# Altium project vcu.PrjPcb
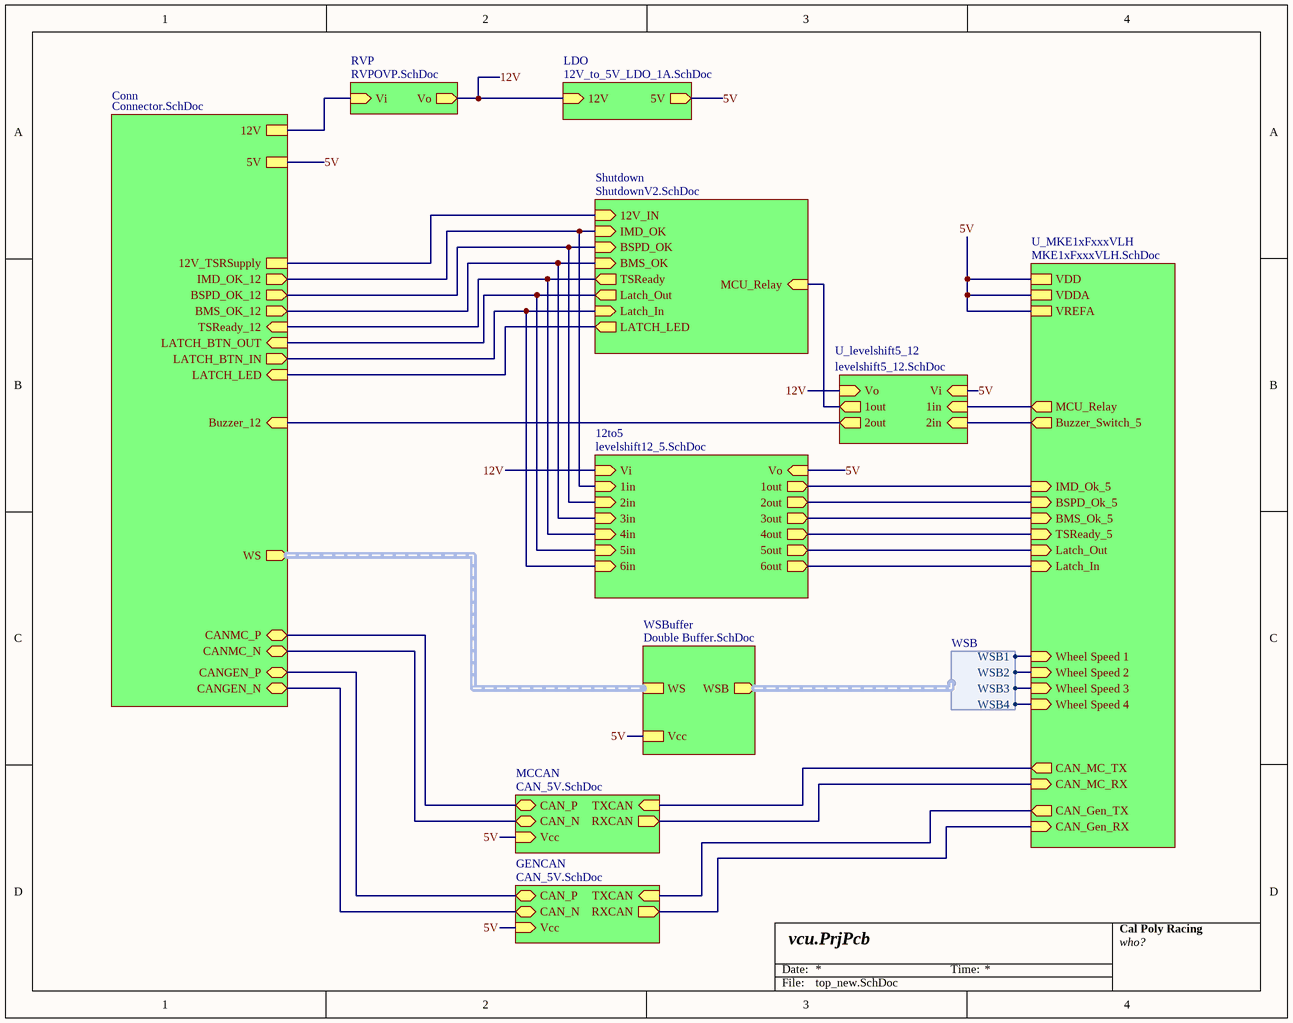
[diagram p0: top_new.SchDoc]
11 sheets, 99 parts. Net scope: hierarchical (ports join the sheet entries above them; power ports are global).
Board file: vcu.PcbDoc
Sheets:
  top_new.SchDoc
    Conn = Connector.SchDoc
    WSBuffer = Double Buffer.SchDoc
    RVP = RVPOVP.SchDoc
    LDO = 12V_to_5V_LDO_1A.SchDoc
    Shutdown = ShutdownV2.SchDoc
    12to5 = levelshift12_5.SchDoc
    U_levelshift5_12 = levelshift5_12.SchDoc
    U_MKE1xFxxxVLH = MKE1xFxxxVLH.SchDoc
      LED 1 = LED.SchDoc
      LED 3 = LED.SchDoc
      LED 4 = LED.SchDoc
      LED 2 = LED.SchDoc
    MCCAN = CAN_5V.SchDoc
    GENCAN = CAN_5V.SchDoc

## Sheet top_new.SchDoc
size A; Organization: Cal Poly Racing; engineer1: who?

### Sub-sheets
12to5 = levelshift12_5.SchDoc: Vi (in), 1in (in), 2in (in), 3in (in), 4in (in), 5in (in), 6in (in), 1out (out), 2out (out), 3out (out), 4out (out), 5out (out), 6out (out), Vo (in)
Conn = Connector.SchDoc: IMD_OK_12 (out), CANMC_P (bidir), TSReady_12 (in), CANGEN_N (bidir), LATCH_BTN_IN (out), 12V_TSRSupply, LATCH_BTN_OUT (in), BMS_OK_12 (out), CANMC_N (bidir), BSPD_OK_12 (out), CANGEN_P (bidir), Buzzer_12 (in), LATCH_LED (in), 12V, 5V, WS (out, harness WS)
GENCAN = CAN_5V.SchDoc: TXCAN (in), RXCAN (out), CAN_N (bidir), CAN_P (bidir), Vcc (in)
LDO = 12V_to_5V_LDO_1A.SchDoc: 12V (in), 5V (out)
MCCAN = CAN_5V.SchDoc: TXCAN (in), RXCAN (out), CAN_N (bidir), CAN_P (bidir), Vcc (in)
RVP = RVPOVP.SchDoc: Vo (out), Vi (in)
Shutdown = ShutdownV2.SchDoc: BMS_OK (in), IMD_OK (in), MCU_Relay (in), LATCH_LED (out), TSReady (out), Latch_Out (out), Latch_In (in), BSPD_OK (in), 12V_IN (in)
U_levelshift5_12 = levelshift5_12.SchDoc: Vi (in), 1in (in), 2in (in), 1out (out), 2out (out), Vo (in)
U_MKE1xFxxxVLH = MKE1xFxxxVLH.SchDoc: VDD, VDDA, VREFA, BSPD_Ok_5 (in), BMS_Ok_5 (in), IMD_Ok_5 (in), Latch_In (in), TSReady_5 (in), Latch_Out (in), MCU_Relay (out), Buzzer_Switch_5 (out), CAN_MC_RX (in), Wheel Speed 2 (in), Wheel Speed 3 (in), Wheel Speed 4 (in), CAN_MC_TX (out), Wheel Speed 1 (in), CAN_Gen_TX (out), CAN_Gen_RX (in)
WSBuffer = Double Buffer.SchDoc: Vcc, WS, WSB (out, harness WSB)

### Harnesses
WSB: WSB1, WSB2, WSB3, WSB4

### Nets
5V: sheet Conn/5V, sheet WSBuffer/Vcc, sheet LDO/5V, sheet 12to5/Vo, sheet U_levelshift5_12/Vi, sheet U_MKE1xFxxxVLH/VDD, sheet U_MKE1xFxxxVLH/VDDA, sheet U_MKE1xFxxxVLH/VREFA, sheet MCCAN/Vcc, sheet GENCAN/Vcc
12V: sheet RVP/Vo, sheet LDO/12V, sheet 12to5/Vi, sheet U_levelshift5_12/Vo
12VTSR: sheet Conn/12V_TSRSupply, sheet Shutdown/12V_IN
CAN_N: sheet Conn/CANMC_N, sheet MCCAN/CAN_N
CAN_N: sheet Conn/CANGEN_N, sheet GENCAN/CAN_N  [a separate net that carries the same name]
CAN_P: sheet Conn/CANMC_P, sheet MCCAN/CAN_P
CAN_P: sheet Conn/CANGEN_P, sheet GENCAN/CAN_P  [a separate net that carries the same name]
RVPI: sheet Conn/12V, sheet RVP/Vi
NetD10#1_2: sheet Conn/LATCH_BTN_IN, sheet Shutdown/Latch_In, sheet 12to5/6in
NetK3_NO: sheet Conn/LATCH_BTN_OUT, sheet Shutdown/Latch_Out, sheet 12to5/5in
NetLATCH_RELAY1_2: sheet Conn/LATCH_LED, sheet Shutdown/LATCH_LED
NetLATCH_RELAY1_6: sheet Conn/TSReady_12, sheet Shutdown/TSReady, sheet 12to5/4in
NetR15_2: sheet U_levelshift5_12/1in, sheet U_MKE1xFxxxVLH/MCU_Relay
NetR16_2: sheet U_levelshift5_12/2in, sheet U_MKE1xFxxxVLH/Buzzer_Switch_5
NetR24#1_2: sheet Conn/IMD_OK_12, sheet Shutdown/IMD_OK, sheet 12to5/1in
NetR25#1_2: sheet Conn/BSPD_OK_12, sheet Shutdown/BSPD_OK, sheet 12to5/2in
NetR26#1_2: sheet Conn/BMS_OK_12, sheet Shutdown/BMS_OK, sheet 12to5/3in
NetU2_4: sheet U_MKE1xFxxxVLH/Wheel Speed 2, sheet WSBuffer/WSB.WSB2
NetU2_6: sheet U_MKE1xFxxxVLH/Wheel Speed 1, sheet WSBuffer/WSB.WSB1
NetU3_4: sheet U_MKE1xFxxxVLH/Wheel Speed 4, sheet WSBuffer/WSB.WSB4
NetU3_6: sheet U_MKE1xFxxxVLH/Wheel Speed 3, sheet WSBuffer/WSB.WSB3
NetU4_2: sheet Shutdown/MCU_Relay, sheet U_levelshift5_12/1out
NetU4_4: sheet Conn/Buzzer_12, sheet U_levelshift5_12/2out
NetU5_5: sheet U_MKE1xFxxxVLH/CAN_Gen_TX, sheet GENCAN/TXCAN
NetU5_6: sheet U_MKE1xFxxxVLH/CAN_Gen_RX, sheet GENCAN/RXCAN
NetU5_14: sheet 12to5/1out, sheet U_MKE1xFxxxVLH/IMD_Ok_5
NetU5_15: sheet 12to5/2out, sheet U_MKE1xFxxxVLH/BSPD_Ok_5
NetU5_16: sheet 12to5/3out, sheet U_MKE1xFxxxVLH/BMS_Ok_5
NetU5_17: sheet 12to5/6out, sheet U_MKE1xFxxxVLH/Latch_In
NetU5_18: sheet 12to5/5out, sheet U_MKE1xFxxxVLH/Latch_Out
NetU5_19: sheet 12to5/4out, sheet U_MKE1xFxxxVLH/TSReady_5
NetU5_55: sheet U_MKE1xFxxxVLH/CAN_MC_TX, sheet MCCAN/TXCAN
NetU5_56: sheet U_MKE1xFxxxVLH/CAN_MC_RX, sheet MCCAN/RXCAN

### Buses and harness runs
harness sheet Conn/WS = sheet WSBuffer/WS

### Notes on the sheet
- Date:
- Time:
- File:

## Sheet Connector.SchDoc
size A; Organization: Cal Poly Racing; engineer1: who?
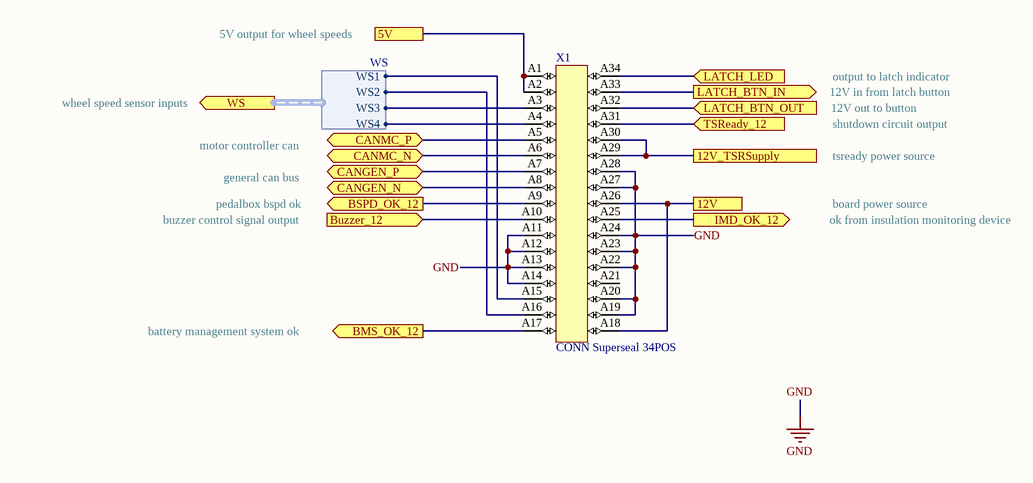
[diagram p1: Connector.SchDoc]

### Parts
X1  CONN Superseal 34POS  [Superseal 34POS]

### Ports
5V, 12V, 12V_TSRSupply, BMS_OK_12 (out), BSPD_OK_12 (out), Buzzer_12 (in), CANGEN_N (bidir), CANGEN_P (bidir), CANMC_N (bidir), CANMC_P (bidir), IMD_OK_12 (out), LATCH_BTN_IN (out), LATCH_BTN_OUT (in), LATCH_LED (in), TSReady_12 (in), WS (out, harness WS)

### Harnesses
WS: WS1, WS2, WS3, WS4

### Nets
GND: X1.A11 X1.A12 X1.A13 X1.A14 X1.A19 X1.A20 X1.A22 X1.A23 X1.A24 X1.A27 X1.A28
5V: X1.A1 X1.A2 ; port 5V
12VTSR: X1.A29 X1.A30 ; port 12V_TSRSupply
CAN_N: X1.A6 ; port CANMC_N
CAN_N: X1.A8 ; port CANGEN_N  [a separate net that carries the same name]
CAN_P: X1.A5 ; port CANMC_P
CAN_P: X1.A7 ; port CANGEN_P  [a separate net that carries the same name]
RVPI: X1.A18 X1.A26 ; port 12V
NetD10#1_2: X1.A33 ; port LATCH_BTN_IN
NetK3_NO: X1.A32 ; port LATCH_BTN_OUT
NetLATCH_RELAY1_2: X1.A34 ; port LATCH_LED
NetLATCH_RELAY1_6: X1.A31 ; port TSReady_12
NetR4_1: X1.A15 ; port WS.WS1
NetR5_1: X1.A16 ; port WS.WS2
NetR8_1: X1.A3 ; port WS.WS3
NetR9_1: X1.A4 ; port WS.WS4
NetR24#1_2: X1.A25 ; port IMD_OK_12
NetR25#1_2: X1.A9 ; port BSPD_OK_12
NetR26#1_2: X1.A17 ; port BMS_OK_12
NetU4_4: X1.A10 ; port Buzzer_12

Not connected (* = marked no-connect by the designer): X1 A21

### Notes on the sheet
- 5V output for wheel speeds
- output to latch indicator
- wheel speed sensor inputs
- motor controller can
- tsready power source
- shutdown circuit output
- 12V out to button
- 12V in from latch button
- pedalbox bspd ok
- general can bus
- buzzer control signal output
- board power source
- ok from insulation monitoring device
- battery management system ok
- Date:
- Time:
- File:

### Library data of the parts
X1 = 11: AMP Superseal 34 POS; id: 11; name: 6437288-1; numcontacts: 34; numrows: 4; pitch: 3mm; quantity: 0; link: https://www.digikey.com/products/en?mpart=6437288-1&&csp=WT.z_cid%3Dsp_8004_20120425_buynow%26TE_cid%3D8004-1541898693362

## Sheet Double Buffer.SchDoc
size A; Organization: Cal Poly Racing; engineer1: who?
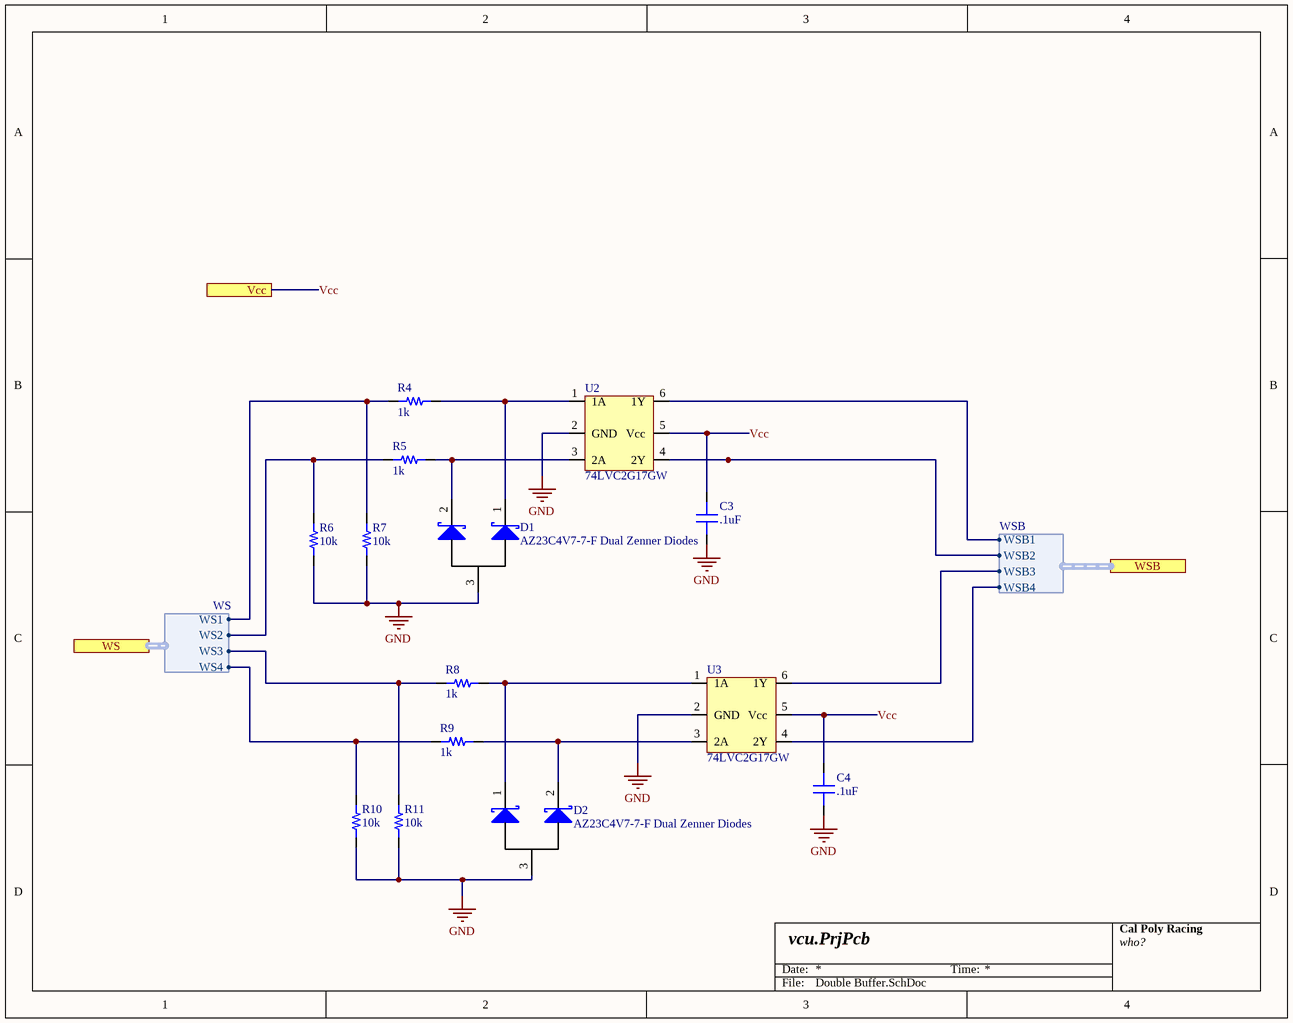
[diagram p2: Double Buffer.SchDoc]

### Parts
C3  capacitance: .1uF  [0603]  (hidden comment: capacitor)
C4  capacitance: .1uF  [0603]  (hidden comment: capacitor)
D1  AZ23C4V7-7-F Dual Zenner Diodes  [SOT23-3]
D2  AZ23C4V7-7-F Dual Zenner Diodes  [SOT23-3]
R4  1k  [RES 0603/1608]
R5  1k  [RES 0603/1608]
R6  10k  [RES 0603/1608]
R7  10k  [RES 0603/1608]
R8  1k  [RES 0603/1608]
R9  1k  [RES 0603/1608]
R10  10k  [RES 0603/1608]
R11  10k  [RES 0603/1608]
U2  74LVC2G17GW  [TSOP95P280X110-6N]
U3  74LVC2G17GW  [TSOP95P280X110-6N]

### Ports
Vcc, WS (harness WS), WSB (harness WSB)

### Harnesses
WS: WS1, WS2, WS3, WS4
WSB: WSB1, WSB2, WSB3, WSB4

### Nets
GND: C3.1 C4.1 D1.3 D2.3 R6.1 R7.1 R10.1 R11.1 U2.2(GND) U3.2(GND)
Vcc: C3.2 C4.2 U2.5(Vcc) U3.5(Vcc) ; port Vcc  [project net 5V]
NetD1_1: D1.1 R4.2 U2.1(1A)
NetD1_2: D1.2 R5.2 U2.3(2A)
NetD2_1: D2.1 R8.2 U3.1(1A)
NetD2_2: D2.2 R9.2 U3.3(2A)
NetR4_1: R4.1 R7.2 ; port WS.WS1
NetR5_1: R5.1 R6.2 ; port WS.WS2
NetR8_1: R8.1 R11.2 ; port WS.WS3
NetR9_1: R9.1 R10.2 ; port WS.WS4
NetU2_4: U2.4(2Y) ; port WSB.WSB2
NetU2_6: U2.6(1Y) ; port WSB.WSB1
NetU3_4: U3.4(2Y) ; port WSB.WSB4
NetU3_6: U3.6(1Y) ; port WSB.WSB3

### Notes on the sheet
- Date:
- Time:
- File:

### Library data of the parts
C3 C4 = 1: Generic 0603 capacitor; id: 1; voltage: 50; dielectric: Ceramic; percent tolerance: 10; name: 0603 Capacitor; ESR: 1; package: 0603; quantity: 0
D1 D2 = 14: DIODE ZENER ARRAY 4.7V SOT23-3; id: 14; name: AZ23C4V7-7-F; package: SOT23-3; quantity: 0; link: https://www.digikey.com/product-detail/en/diodes-incorporated/AZ23C4V7-7-F/AZ23C4V7-FDICT-ND/815309
R4-R11 = 1: id: 1; name: 0603 Resistor; percent tolerance: 5; package: 0603; quantity: 0
  R4 R5 R8 R9: resistance: 1k
  R6 R7 R10 R11: resistance: 10k
U2 U3 = 17: Buffer, Non-Inverting 2 Element 1 Bit per Element Push-Pull Output 6-TSSOP; id: 17; vcc: 5; updatedby: Nolan; name: 74LVC2G17; type: buffer; package: SOT457; quantity: 0; createdby: Nolan; createddate: 10/16/2019 10:08:58 PM; updateddate: 10/16/2019 10:08:58 PM

## Sheet RVPOVP.SchDoc
size A; Organization: Cal Poly Racing; engineer1: who?
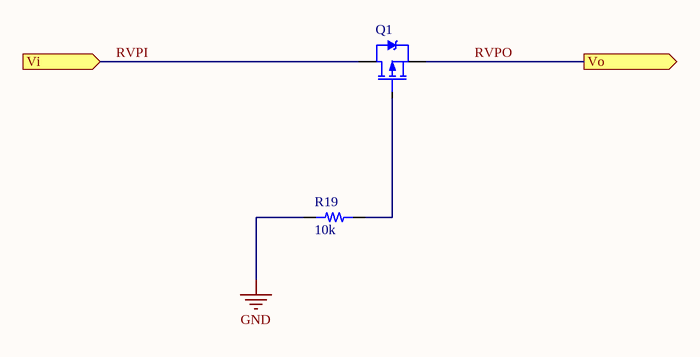
[diagram p3: RVPOVP.SchDoc]

### Parts
Q1  DMP3010LK3-13  [DMP3010LK3-13]  (value not drawn)
R19  10k  [RES 0603/1608]

### Ports
Vi (in), Vo (out)

### Nets
GND: R19.1
RVPI: Q1.3(D) ; port Vi
RVPO: Q1.2(S) ; port Vo  [project net 12V]
NetQ1_1: Q1.1(G) R19.2

### Notes on the sheet
- Date:
- Time:
- File:

### Library data of the parts
Q1 = 26: P-Channel MOSFET 30V 17A TO252; Manufacturer_id: 1; idFuse: 3; id: 26; type: P_Channel; vdsmax: 30; rdson: 8mOhm; vgsmax: 20; Drawer_id: 1; Name: DMP3010LK3-13; numcircuits: 1; current: 17A; package: TO-252-3; quantity: 0; link: https://www.digikey.com/product-detail/en/diodes-incorporated/DMP3010LK3-13/DMP3010LK3-13DICT-ND/3076574; createdby: Kevin
R19 = 1: as R4 on sheet Double Buffer; resistance: 10k; package: 0603; quantity: 0

## Sheet 12V_to_5V_LDO_1A.SchDoc
size A; Organization: Cal Poly Racing; engineer1: who?
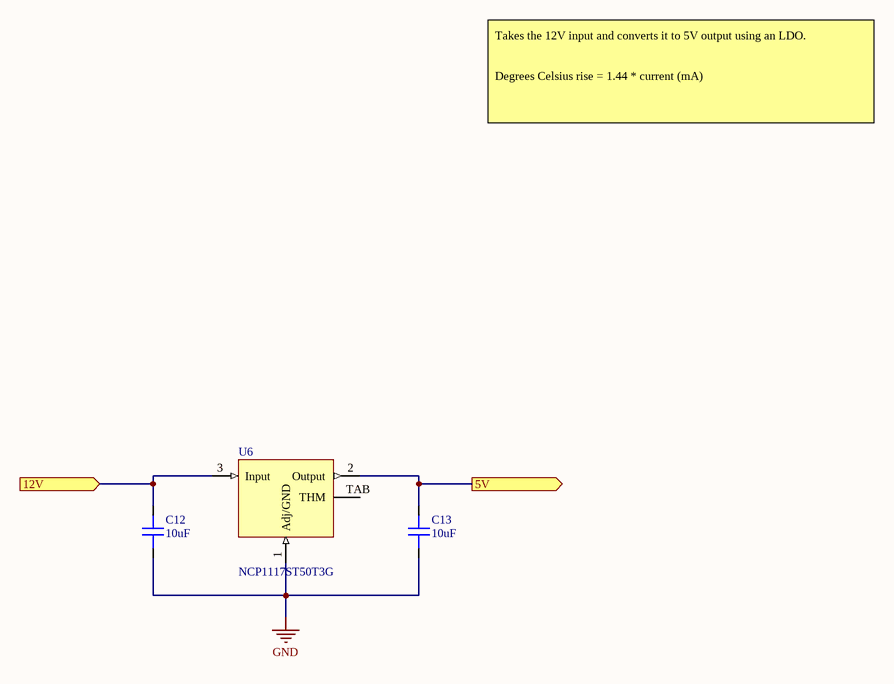
[diagram p4: 12V_to_5V_LDO_1A.SchDoc]

### Parts
C12  capacitance: 10uF  [0603]  (hidden comment: capacitor)
C13  capacitance: 10uF  [0603]  (hidden comment: capacitor)
U6  NCP1117ST50T3G  [SOT-223-3]

### Ports
5V (out), 12V (in)

### Nets
GND: C12.1 C13.1 U6.1(Adj/GND)
5V: C13.2 U6.2(Output) ; port 5V
12V: C12.2 U6.3(Input) ; port 12V

Not connected (* = marked no-connect by the designer): U6 TAB(THM)

### Notes on the sheet
- Takes the 12V input and converts it to 5V output using an LDO.
  Degrees Celsius rise = 1.44 * current (mA)
- Date:
- Time:
- File:

### Library data of the parts
C12 C13 = 1: as C3 on sheet Double Buffer; name: 0603 Capacitor; ESR: 1; package: 0603; quantity: 0
U6 = 16: 5V linear regulator; id: 16; imax: 1; name: NCP1117ST50T3G; package: SOT-223-3; quantity: 0; link: https://www.digikey.com/product-detail/en/on-semiconductor/NCP1117ST50T3G/NCP1117ST50T3GOSCT-ND/1967217

## Sheet ShutdownV2.SchDoc
size A; Organization: Cal Poly Racing; engineer1: who?
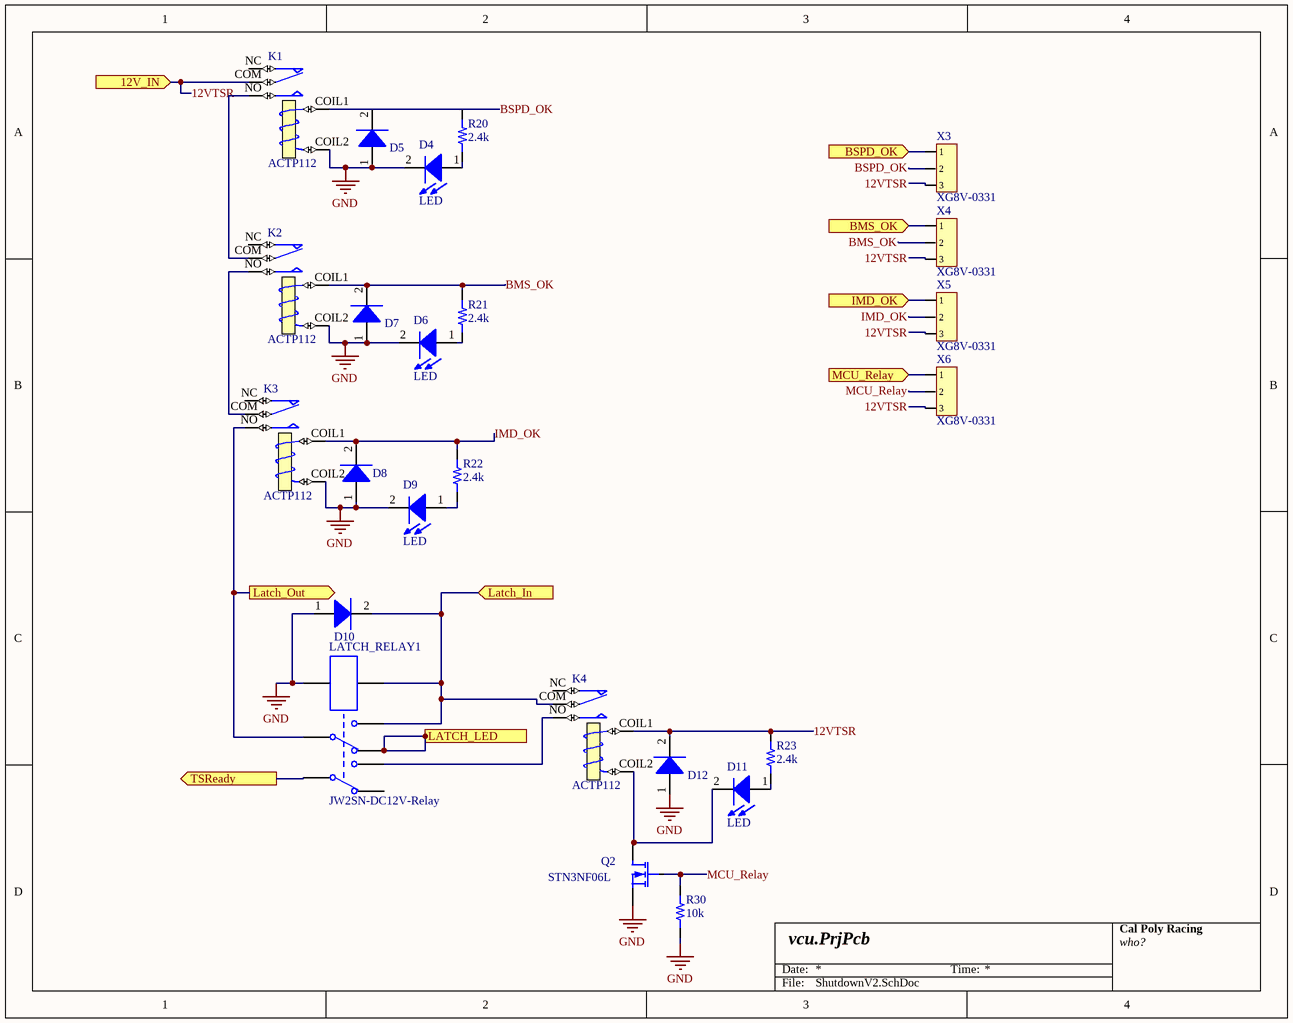
[diagram p5: ShutdownV2.SchDoc]

### Parts
(Parts that share a designator on the sheet are numbered #1, #2 ... from top to bottom, then left to right.)
D4  LED  [0805_LED]
D5  *  [SOD123F]  (value not drawn)
D6  LED  [0805_LED]
D7#1  *  [SOD123F]  (value not drawn)
D8#1  *  [SOD123F]  (value not drawn)
D9#1  LED  [0805_LED]
D10#1  *  [SOD123F]  (value not drawn)
D11  LED  [0805_LED]
D12  *  [SOD123F]  (value not drawn)
K1  ACTP112  [ACTP112]
K2  ACTP112  [ACTP112]
K3  ACTP112  [ACTP112]
K4  ACTP112  [ACTP112]
LATCH_RELAY1  JW2SN-DC12V-Relay  [JW2SN-DC12V-Relay]
Q2  STN3NF06L  [STN3NF06L]
R20  2.4k  [RES 0603/1608]
R21  2.4k  [RES 0603/1608]
R22  2.4k  [RES 0603/1608]
R23#1  2.4k  [RES 0603/1608]
R30#1  10k  [RES 0603/1608]
X3  XG8V-0331  [XG8V-0331]
X4  XG8V-0331  [XG8V-0331]
X5  XG8V-0331  [XG8V-0331]
X6  XG8V-0331  [XG8V-0331]

### Ports
12V_IN (in), BMS_OK (in), BSPD_OK (in), IMD_OK (in), Latch_In (in), LATCH_LED (out), Latch_Out (out), MCU_Relay (in), TSReady (out)

### Nets
GND: D4.2(K) D5.1(A) D6.2(K) D7#1.1(A) D8#1.1(A) D9#1.2(K) D10#1.1(A) D12.1(A) K1.COIL2(T2) K2.COIL2(T2) K3.COIL2(T2) LATCH_RELAY1.1(COIL1) Q2.3(S) R30#1.1
12VTSR: D12.2(K) K1.COM K4.COIL1(T1) R23#1.2 X3.3 X4.3 X5.3 X6.3 ; port 12V_IN
BMS_OK: D7#1.2(K) K2.COIL1(T1) R21.2 X4.2
BSPD_OK: D5.2(K) K1.COIL1(T1) R20.2 X3.2
IMD_OK: D8#1.2(K) K3.COIL1(T1) R22.2 X5.2
MCU_Relay: Q2.1(G) R30#1.2 X6.2
NetD4_1: D4.1(A) R20.1
NetD6_1: D6.1(A) R21.1
NetD9#1_1: D9#1.1(A) R22.1
NetD10#1_2: D10#1.2(K) K4.COM LATCH_RELAY1.4(N.O1) LATCH_RELAY1.8(COIL2) ; port Latch_In
NetD11_1: D11.1(A) R23#1.1
NetD11_2: D11.2(K) K4.COIL2(T2) Q2.2(D)
NetK1_NO: K1.NO K2.COM
NetK2_NO: K2.NO K3.COM
NetK3_NO: K3.NO LATCH_RELAY1.3(COM1) ; port Latch_Out
NetK4_NO: K4.NO LATCH_RELAY1.5(N.O2)
NetLATCH_RELAY1_2: LATCH_RELAY1.2(N.C1) ; port LATCH_LED
NetLATCH_RELAY1_6: LATCH_RELAY1.6(COM2) ; port TSReady
NetR24#1_2: X5.1 ; port IMD_OK
NetR25#1_2: X3.1 ; port BSPD_OK
NetR26#1_2: X4.1 ; port BMS_OK
NetU4_2: X6.1 ; port MCU_Relay

Not connected (* = marked no-connect by the designer): K1 NC; K2 NC; K3 NC; K4 NC; LATCH_RELAY1 7(N.C2)

### Notes on the sheet
- Date:
- Time:
- File:

### Library data of the parts
D4 D6 D9#1 D11 = 19: Generic 0805 LED; id: 19; vr: 1; name: 0805 LED; numcircuits: 1; package: 0805; quantity: 0
D5 D7#1 D8#1 D10#1 D12 = 2: Diode Super Barrier 40V 1A Surface Mount SOD-; id: 2; name: 1N5819; mfrpartno: *; package: SOD-123; quantity: 0; link: https://www.digikey.com/product-detail/en/diodes-incorporated/1N5819HW1-7-F/1N5819HW1-7-FDITR-ND/5768523
K1-K4 = 1: id: 1; current: 0; voltage: 12; Published: 8-Jun-2000; LatestRevisionDate: 17-Jul-2002; LatestRevisionNote: Re-released for DXP Platform.; PackageReference: MODULE5B; Publisher: Altium Limited; name: ACTP112; quantity: 0; link: https://www.digikey.com/product-detail/en/panasonic-electric-works/ACTP112/255-5163-ND/4691838; createdby: Kevin
LATCH_RELAY1 = 2: Manufacturer_id: 1; idRelay: 2; Name: Relay JW2SN-DC12; Drawer_id: 1
Q2 = 8: MOSFET N-CH 60V 4A SOT223; id: 8; type: N_Channel; vdsmax: 0; numcircuits: 1; rdson: 70m; name: STN3NF06L; current: 4A; vgsmax: 0; package: SOT-233; quantity: 0; link: https://www.digikey.com/product-detail/en/stmicroelectronics/STN3NF06L/497-3177-1-ND/654516
R20-R22 R23#1 R30#1 = 1: as R4 on sheet Double Buffer; package: 0603; quantity: 0
  R20-R23: resistance: 2.4k
  R30: resistance: 10k
X3-X6 = 8: XG8V-0331_3pin_header; id: 8; numcontacts: 3; pitch: 2.54 mm; quantity: 0; link: https://www.digikey.com/products/en/connectors-interconnects/rectangular-connectors-headers-male-pins/314?k=jumper&k=&pkeyword=jumper&pv88=5&sf=0&FV=ffe0013a&quantity=&ColumnSort=0&page=1&pageSize=25

## Sheet levelshift12_5.SchDoc
size A; Organization: Cal Poly Racing; engineer1: who?
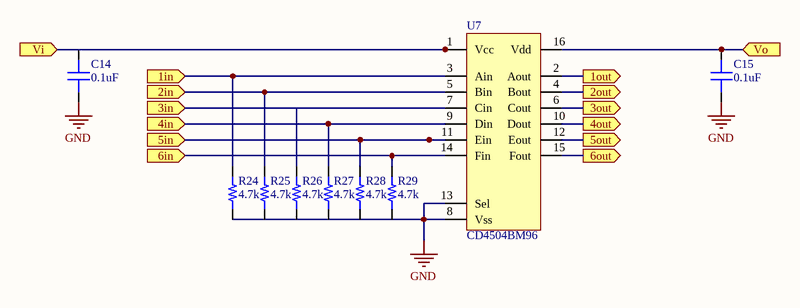
[diagram p6: levelshift12_5.SchDoc]

### Parts
(Parts that share a designator on the sheet are numbered #1, #2 ... from top to bottom, then left to right.)
C14#1  capacitance: 0.1uF  [0603]  (hidden comment: capacitor)
C15#1  capacitance: 0.1uF  [0603]  (hidden comment: capacitor)
R24#1  4.7k  [RES 0603/1608]
R25#1  4.7k  [RES 0603/1608]
R26#1  4.7k  [RES 0603/1608]
R27#1  4.7k  [RES 0603/1608]
R28#1  4.7k  [RES 0603/1608]
R29#1  4.7k  [RES 0603/1608]
U7#1  CD4504BM96  [SOIC-16]

### Ports
1in (in), 1out (out), 2in (in), 2out (out), 3in (in), 3out (out), 4in (in), 4out (out), 5in (in), 5out (out), 6in (in), 6out (out), Vi (in), Vo (in)

### Nets
GND: C14#1.1 C15#1.1 R24#1.1 R25#1.1 R26#1.1 R27#1.1 R28#1.1 R29#1.1 U7#1.8(Vss) U7#1.13(Sel)
5V: C15#1.2 U7#1.16(Vdd) ; port Vo
12V: C14#1.2 U7#1.1(Vcc) ; port Vi
NetD10#1_2: R29#1.2 U7#1.14(Fin) ; port 6in
NetK3_NO: R28#1.2 U7#1.11(Ein) ; port 5in
NetLATCH_RELAY1_6: R27#1.2 U7#1.9(Din) ; port 4in
NetR24#1_2: R24#1.2 U7#1.3(Ain) ; port 1in
NetR25#1_2: R25#1.2 U7#1.5(Bin) ; port 2in
NetR26#1_2: R26#1.2 U7#1.7(Cin) ; port 3in
NetU5_14: U7#1.2(Aout) ; port 1out
NetU5_15: U7#1.4(Bout) ; port 2out
NetU5_16: U7#1.6(Cout) ; port 3out
NetU5_17: U7#1.15(Fout) ; port 6out
NetU5_18: U7#1.12(Eout) ; port 5out
NetU5_19: U7#1.10(Dout) ; port 4out

### Notes on the sheet
- Date:
- Time:
- File:

### Library data of the parts
C14#1 C15#1 = 1: Generic 0603 capacitor; id: 1
R24#1 R25#1 R26#1 R27#1 R28#1 R29#1 = 1: as R4 on sheet Double Buffer; resistance: 4.7k; package: 0603; quantity: 0
U7#1 = 1: Voltage Level Translator Unidirectional 1 Cir; id: 1; Vcc: 20; Name: CD4504BM96; type: Level shifter CMOS-CMOS; package: SOIC-16; quantity: 0; link: https://www.digikey.com/product-detail/en/texas-instruments/CD4504BM96/296-14150-2-ND/525968

## Sheet levelshift5_12.SchDoc
size A; Organization: Cal Poly Racing; engineer1: who?
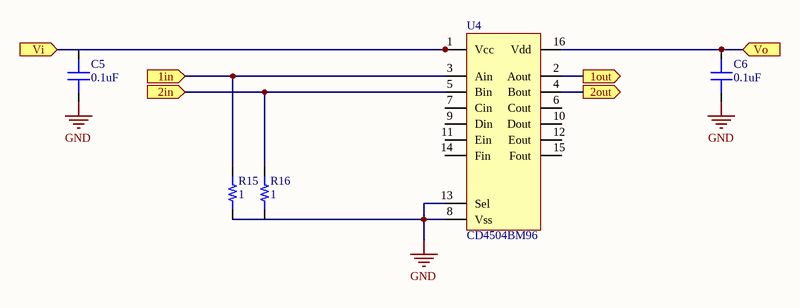
[diagram p7: levelshift5_12.SchDoc]

### Parts
C5  capacitance: 0.1uF  [0603]  (hidden comment: capacitor)
C6  capacitance: 0.1uF  [0603]  (hidden comment: capacitor)
R15  1  [RES 0603/1608]
R16  1  [RES 0603/1608]
U4  CD4504BM96  [SOIC-16]

### Ports
1in (in), 1out (out), 2in (in), 2out (out), Vi (in), Vo (in)

### Nets
GND: C5.1 C6.1 R15.1 R16.1 U4.8(Vss) U4.13(Sel)
5V: C5.2 U4.1(Vcc) ; port Vi
12V: C6.2 U4.16(Vdd) ; port Vo
NetR15_2: R15.2 U4.3(Ain) ; port 1in
NetR16_2: R16.2 U4.5(Bin) ; port 2in
NetU4_2: U4.2(Aout) ; port 1out
NetU4_4: U4.4(Bout) ; port 2out

Not connected (* = marked no-connect by the designer): U4 6(Cout) 7(Cin) 9(Din) 10(Dout) 11(Ein) 12(Eout) 14(Fin) 15(Fout)

### Notes on the sheet
- Date:
- Time:
- File:

### Library data of the parts
C5 C6 = 1: Generic 0603 capacitor; id: 1
R15 R16 = 1: name: 0603 Resistor; percent tolerance: 5; id: 1; resistance: 1; package: 0603; quantity: 0
U4 = 1: as U7#1 on sheet levelshift12_5; Name: CD4504BM96; type: Level shifter CMOS-CMOS; package: SOIC-16; quantity: 0; link: https://www.digikey.com/product-detail/en/texas-instruments/CD4504BM96/296-14150-2-ND/525968

## Sheet MKE1xFxxxVLH.SchDoc
size A; Organization: Cal Poly Racing; engineer1: who?
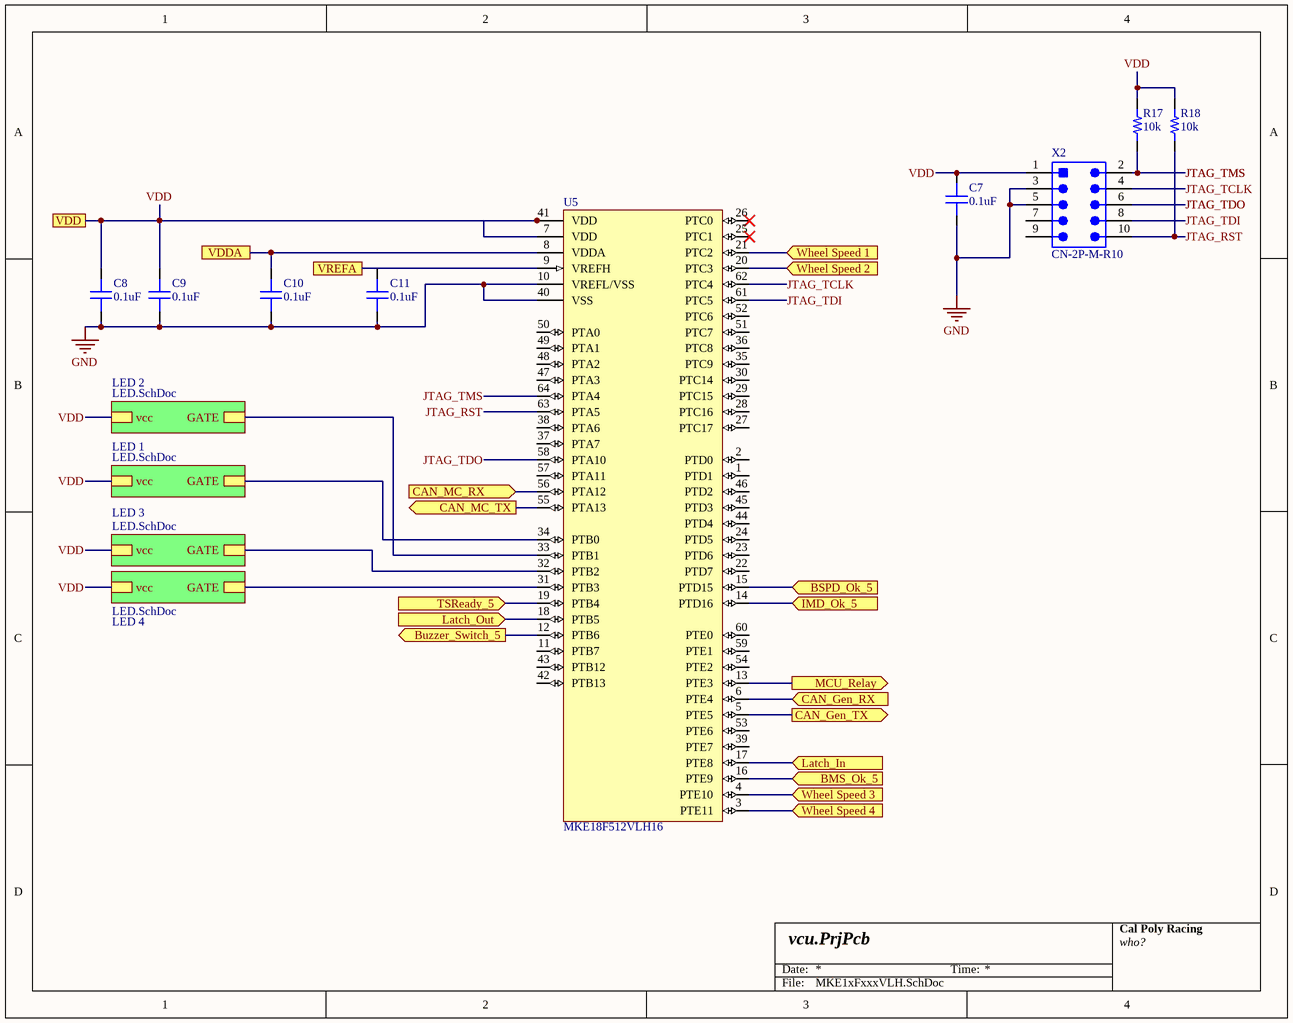
[diagram p8: MKE1xFxxxVLH.SchDoc]

### Parts
C7  capacitance: 0.1uF  [0603]  (hidden comment: capacitor)
C8  capacitance: 0.1uF  [0603]  (hidden comment: capacitor)
C9  capacitance: 0.1uF  [0603]  (hidden comment: capacitor)
C10  capacitance: 0.1uF  [0603]  (hidden comment: capacitor)
C11  capacitance: 0.1uF  [0603]  (hidden comment: capacitor)
R17  10k  [RES 0603/1608]
R18  10k  [RES 0603/1608]
U5  MKE18F512VLH16  [TQFP64]
X2  CN-2P-M-R10  [HDR2X5_SMT]

### Sub-sheets
LED 1 = LED.SchDoc: GATE, vcc
LED 2 = LED.SchDoc: GATE, vcc
LED 3 = LED.SchDoc: GATE, vcc
LED 4 = LED.SchDoc: GATE, vcc

### Ports
BMS_Ok_5 (in), BSPD_Ok_5 (in), Buzzer_Switch_5 (out), CAN_Gen_RX (in), CAN_Gen_TX (out), CAN_MC_RX (in), CAN_MC_TX (out), IMD_Ok_5 (in), Latch_In (in), Latch_Out (in), MCU_Relay (out), TSReady_5 (in), VDD, VDDA, VREFA, Wheel Speed 1 (in), Wheel Speed 2 (in), Wheel Speed 3 (in), Wheel Speed 4 (in)

### Nets
GND: C7.1 C8.1 C9.1 C10.1 C11.1 U5.10(VREFL/VSS) U5.40(VSS) X2.3 X2.5
JTAG_RST: R18.1 U5.63(PTA5) X2.10
JTAG_TCLK: U5.62(PTC4) X2.4
JTAG_TDI: U5.61(PTC5) X2.8
JTAG_TDO: U5.58(PTA10) X2.6
JTAG_TMS: R17.1 U5.64(PTA4) X2.2
VDD: C7.2 C8.2 C9.2 C10.2 C11.2 R17.2 R18.2 U5.7(VDD) U5.8(VDDA) U5.9(VREFH) U5.41(VDD) X2.1 ; port VDD, port VDDA, port VREFA, sheet LED 1/vcc, sheet LED 3/vcc, sheet LED 4/vcc, sheet LED 2/vcc  [project net 5V]
NetR15_2: U5.13(PTE3) ; port MCU_Relay
NetR16_2: U5.12(PTB6) ; port Buzzer_Switch_5
NetR23#2_2: U5.34(PTB0) ; sheet LED 1/GATE
NetR24#2_2: U5.33(PTB1) ; sheet LED 2/GATE
NetR25#2_2: U5.32(PTB2) ; sheet LED 3/GATE
NetR26#2_2: U5.31(PTB3) ; sheet LED 4/GATE
NetU2_4: U5.20(PTC3) ; port Wheel Speed 2
NetU2_6: U5.21(PTC2) ; port Wheel Speed 1
NetU3_4: U5.3(PTE11) ; port Wheel Speed 4
NetU3_6: U5.4(PTE10) ; port Wheel Speed 3
NetU5_5: U5.5(PTE5) ; port CAN_Gen_TX
NetU5_6: U5.6(PTE4) ; port CAN_Gen_RX
NetU5_14: U5.14(PTD16) ; port IMD_Ok_5
NetU5_15: U5.15(PTD15) ; port BSPD_Ok_5
NetU5_16: U5.16(PTE9) ; port BMS_Ok_5
NetU5_17: U5.17(PTE8) ; port Latch_In
NetU5_18: U5.18(PTB5) ; port Latch_Out
NetU5_19: U5.19(PTB4) ; port TSReady_5
NetU5_55: U5.55(PTA13) ; port CAN_MC_TX
NetU5_56: U5.56(PTA12) ; port CAN_MC_RX

Not connected (* = marked no-connect by the designer): U5 1(PTD1) 2(PTD0) 11(PTB7) 22(PTD7) 23(PTD6) 24(PTD5) 25(PTC1)* 26(PTC0)* 27(PTC17) 28(PTC16) 29(PTC15) 30(PTC14) 35(PTC9) 36(PTC8) 37(PTA7) 38(PTA6) 39(PTE7) 42(PTB13) 43(PTB12) 44(PTD4) 45(PTD3) 46(PTD2) 47(PTA3) 48(PTA2) 49(PTA1) 50(PTA0) 51(PTC7) 52(PTC6) 53(PTE6) 54(PTE2) 57(PTA11) 59(PTE1) 60(PTE0); X2 7 9

### Notes on the sheet
- Date:
- Time:
- File:

### Library data of the parts
C7-C11 = 1: as C3 on sheet Double Buffer; Name: 0603 Capacitor; ESR: 1; package: 0603; quantity: 0
R17 R18 = 1: as R4 on sheet Double Buffer; resistance: 10k; package: 0603; quantity: 0
U5 = 1: 32b NXP Microcontroller; id: 1; voltagemin: 2.70000004768372; voltagemax: 5.5; name: MKE18F512VLH16; package: TQFP64; quantity: 0
X2 = 4: CONN_TE_2X5POS; id: 4; Name: 5103309-1; numcontacts: 10; numrows: 2; pitch: 2.54mm; MfrPartNo: *; link: https://www.digikey.com/product-detail/en/5103309-1/A33160-ND/1114898?utm_campaign=buynow&WT.z_cid=ref_octopart_dkc_buynow&utm_medium=aggregator&curr=usd&site=us&utm_source=octopart; quantity: 0

## Sheet LED.SchDoc
size A; Organization: Cal Poly Racing; engineer1: who?
Used 4 times, as channels U_MKE1xFxxxVLH/LED 1, U_MKE1xFxxxVLH/LED 3, U_MKE1xFxxxVLH/LED 4, U_MKE1xFxxxVLH/LED 2. Parts and nets are listed once, with the designators drawn on the sheet.
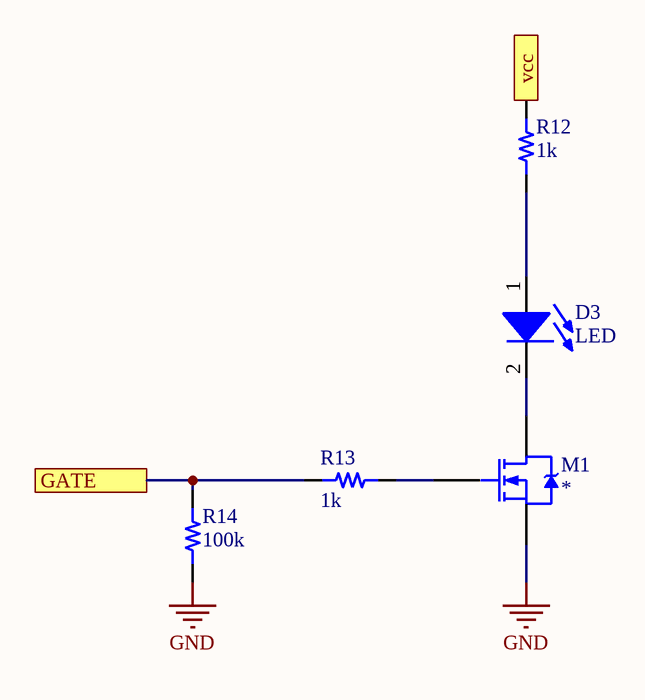
[diagram p9: LED.SchDoc]

### Parts
D3  LED  [0805_LED]
M1  *  [SOT23-3]
R12  resistance: 1k  [RES 0603/1608]
R13  resistance: 1k  [RES 0603/1608]
R14  resistance: 100k  [RES 0603/1608]

### Ports
GATE, vcc

### Nets
GND: M1.2(S) R14.1
GATE: R13.2 R14.2 ; port GATE
vcc: R12.2 ; port vcc
NetD3_1: D3.1(A) R12.1
NetD3_2: D3.2(K) M1.3(D)
NetM1_1: M1.1(G) R13.1

### Channels
U_MKE1xFxxxVLH/LED 1: designators D3=D7#2 M1=M1 R12=R31 R13=R23#2 R14=R27#2; ports GATE=NetR23#2_2 vcc=5V
U_MKE1xFxxxVLH/LED 3: designators D3=D9#2 M1=M3 R12=R33 R13=R25#2 R14=R29#2; ports GATE=NetR25#2_2 vcc=5V
U_MKE1xFxxxVLH/LED 4: designators D3=D10#2 M1=M4 R12=R34 R13=R26#2 R14=R30#2; ports GATE=NetR26#2_2 vcc=5V
U_MKE1xFxxxVLH/LED 2: designators D3=D8#2 M1=M2 R12=R32 R13=R24#2 R14=R28#2; ports GATE=NetR24#2_2 vcc=5V

### Notes on the sheet
- Date:
- Time:
- File:

### Library data of the parts
D3 = 19: Generic 0805 LED; id: 19; vr: 1; name: 0805 LED; numcircuits: 1; package: 0805; quantity: 0
M1 = 6: MOSFET N-CHANNEL 30V 5A SOT23; id: 6; vdsmax: 0; numcircuits: 1; current: 2.8A; rdson: 90mOhm; vt: 800; MfrPartNo: *; name: DMG2302UK-7; type: N_Channel; vgsmax: 1; package: SOT-23; quantity: 0; link: https://www.digikey.com/product-detail/en/diodes-incorporated/DMG2302UK-7/DMG2302UK-7DICT-ND/6010163
R12-R14 = 1: as R4 on sheet Double Buffer; package: 0603; quantity: 0

## Sheet CAN_5V.SchDoc
size A; Organization: Cal Poly Racing; engineer1: who?
Used 2 times, as channels MCCAN, GENCAN. Parts and nets are listed once, with the designators drawn on the sheet.
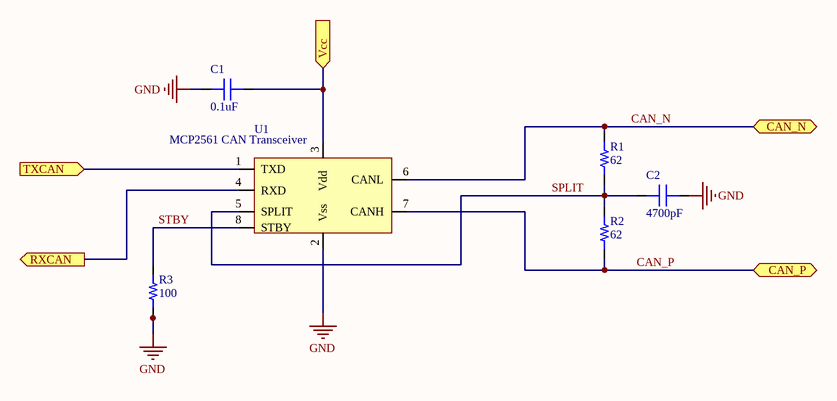
[diagram p10: CAN_5V.SchDoc]

### Parts
C1  capacitance: 0.1uF  [0603]  (hidden comment: capacitor)
C2  capacitance: 4700pF  [0603]  (hidden comment: capacitor)
R1  62  [RES 0603/1608]
R2  62  [RES 0603/1608]
R3  100  [RES 0603/1608]
U1  MCP2561 CAN Transceiver  [SOIC-8]

### Ports
CAN_N (bidir), CAN_P (bidir), RXCAN (out), TXCAN (in), Vcc (in)

### Nets
GND: C1.1 C2.2 R3.1 U1.2(Vss)
CAN_N: R1.2 U1.6(CANL) ; port CAN_N
CAN_P: R2.1 U1.7(CANH) ; port CAN_P
RXCAN: U1.4(RXD) ; port RXCAN
SPLIT: C2.1 R1.1 R2.2 U1.5(SPLIT)
STBY: R3.2 U1.8(STBY)
TXCAN: U1.1(TXD) ; port TXCAN
Vcc: C1.2 U1.3(Vdd) ; port Vcc

### Channels
MCCAN: designators C1=C14#2 C2=C16 R1=R42 R2=R41 R3=R37 U1=U7#2; ports CAN_N=CAN_N CAN_P=CAN_P RXCAN=NetU5_56 TXCAN=NetU5_55 Vcc=5V
GENCAN: designators C1=C15#2 C2=C17 R1=R40 R2=R39 R3=R38 U1=U8; ports CAN_N=CAN_N CAN_P=CAN_P RXCAN=NetU5_6 TXCAN=NetU5_5 Vcc=5V

### Notes on the sheet
- Date:
- Time:
- File:

### Library data of the parts
C1 C2 = 1: as C3 on sheet Double Buffer; name: 0603 Capacitor; ESR: 1; package: 0603; quantity: 0
R1-R3 = 1: as R4 on sheet Double Buffer; package: 0603; quantity: 0
  R1 R2: resistance: 62
  R3: resistance: 100
U1 = 5: id: 5; name: null; vcc: 0; type: CAN; package: SOIC-8; quantity: 0; link: https://www.digikey.com/product-detail/en/microchip-technology/MCP2561T-E-SN/MCP2561T-E-SNCT-ND/5148846

## Nets that join several sheets
GND: Connector (11 pins), Double Buffer (10 pins), RVPOVP (R19.1), 12V_to_5V_LDO_1A (C12.1 C13.1 U6.1), ShutdownV2 (14 pins), levelshift12_5 (10 pins), levelshift5_12 (6 pins), MKE1xFxxxVLH (9 pins), U_MKE1xFxxxVLH/LED 1 (M1.2 R27#2.1), U_MKE1xFxxxVLH/LED 3 (M3.2 R29#2.1), U_MKE1xFxxxVLH/LED 4 (M4.2 R30#2.1), U_MKE1xFxxxVLH/LED 2 (M2.2 R28#2.1), MCCAN (C14#2.1 C16.2 R37.1 U7#2.2), GENCAN (C15#2.1 C17.2 R38.1 U8.2)
5V: Connector (X1.A1 X1.A2), Double Buffer (C3.2 C4.2 U2.5 U3.5), 12V_to_5V_LDO_1A (C13.2 U6.2), levelshift12_5 (C15#1.2 U7#1.16), levelshift5_12 (C5.2 U4.1), MKE1xFxxxVLH (12 pins), U_MKE1xFxxxVLH/LED 1 (R31.2), U_MKE1xFxxxVLH/LED 3 (R33.2), U_MKE1xFxxxVLH/LED 4 (R34.2), U_MKE1xFxxxVLH/LED 2 (R32.2), MCCAN (C14#2.2 U7#2.3), GENCAN (C15#2.2 U8.3)
12V: RVPOVP (Q1.2), 12V_to_5V_LDO_1A (C12.2 U6.3), levelshift12_5 (C14#1.2 U7#1.1), levelshift5_12 (C6.2 U4.16)
12VTSR: Connector (X1.A29 X1.A30), ShutdownV2 (8 pins)
CAN_N: Connector (X1.A6), MCCAN (R42.2 U7#2.6)
CAN_N: Connector (X1.A8), GENCAN (R40.2 U8.6)
CAN_P: Connector (X1.A5), MCCAN (R41.1 U7#2.7)
CAN_P: Connector (X1.A7), GENCAN (R39.1 U8.7)
NetD10#1_2: Connector (X1.A33), ShutdownV2 (D10#1.2 K4.COM LATCH_RELAY1.4 LATCH_RELAY1.8), levelshift12_5 (R29#1.2 U7#1.14)
NetK3_NO: Connector (X1.A32), ShutdownV2 (K3.NO LATCH_RELAY1.3), levelshift12_5 (R28#1.2 U7#1.11)
NetLATCH_RELAY1_2: Connector (X1.A34), ShutdownV2 (LATCH_RELAY1.2)
NetLATCH_RELAY1_6: Connector (X1.A31), ShutdownV2 (LATCH_RELAY1.6), levelshift12_5 (R27#1.2 U7#1.9)
NetR4_1: Connector (X1.A15), Double Buffer (R4.1 R7.2)
NetR5_1: Connector (X1.A16), Double Buffer (R5.1 R6.2)
NetR8_1: Connector (X1.A3), Double Buffer (R8.1 R11.2)
NetR9_1: Connector (X1.A4), Double Buffer (R9.1 R10.2)
NetR15_2: levelshift5_12 (R15.2 U4.3), MKE1xFxxxVLH (U5.13)
NetR16_2: levelshift5_12 (R16.2 U4.5), MKE1xFxxxVLH (U5.12)
NetR23#2_2: MKE1xFxxxVLH (U5.34), U_MKE1xFxxxVLH/LED 1 (R23#2.2 R27#2.2)
NetR24#1_2: Connector (X1.A25), ShutdownV2 (X5.1), levelshift12_5 (R24#1.2 U7#1.3)
NetR24#2_2: MKE1xFxxxVLH (U5.33), U_MKE1xFxxxVLH/LED 2 (R24#2.2 R28#2.2)
NetR25#1_2: Connector (X1.A9), ShutdownV2 (X3.1), levelshift12_5 (R25#1.2 U7#1.5)
NetR25#2_2: MKE1xFxxxVLH (U5.32), U_MKE1xFxxxVLH/LED 3 (R25#2.2 R29#2.2)
NetR26#1_2: Connector (X1.A17), ShutdownV2 (X4.1), levelshift12_5 (R26#1.2 U7#1.7)
NetR26#2_2: MKE1xFxxxVLH (U5.31), U_MKE1xFxxxVLH/LED 4 (R26#2.2 R30#2.2)
NetU2_4: Double Buffer (U2.4), MKE1xFxxxVLH (U5.20)
NetU2_6: Double Buffer (U2.6), MKE1xFxxxVLH (U5.21)
NetU3_4: Double Buffer (U3.4), MKE1xFxxxVLH (U5.3)
NetU3_6: Double Buffer (U3.6), MKE1xFxxxVLH (U5.4)
NetU4_2: ShutdownV2 (X6.1), levelshift5_12 (U4.2)
NetU4_4: Connector (X1.A10), levelshift5_12 (U4.4)
NetU5_5: MKE1xFxxxVLH (U5.5), GENCAN (U8.1)
NetU5_6: MKE1xFxxxVLH (U5.6), GENCAN (U8.4)
NetU5_14: levelshift12_5 (U7#1.2), MKE1xFxxxVLH (U5.14)
NetU5_15: levelshift12_5 (U7#1.4), MKE1xFxxxVLH (U5.15)
NetU5_16: levelshift12_5 (U7#1.6), MKE1xFxxxVLH (U5.16)
NetU5_17: levelshift12_5 (U7#1.15), MKE1xFxxxVLH (U5.17)
NetU5_18: levelshift12_5 (U7#1.12), MKE1xFxxxVLH (U5.18)
NetU5_19: levelshift12_5 (U7#1.10), MKE1xFxxxVLH (U5.19)
NetU5_55: MKE1xFxxxVLH (U5.55), MCCAN (U7#2.1)
NetU5_56: MKE1xFxxxVLH (U5.56), MCCAN (U7#2.4)
RVPI: Connector (X1.A18 X1.A26), RVPOVP (Q1.3)